# Altium schematic sheet ESP32Schematic.SchDoc
size A4; SheetNumber: 1; SheetTotal: 2
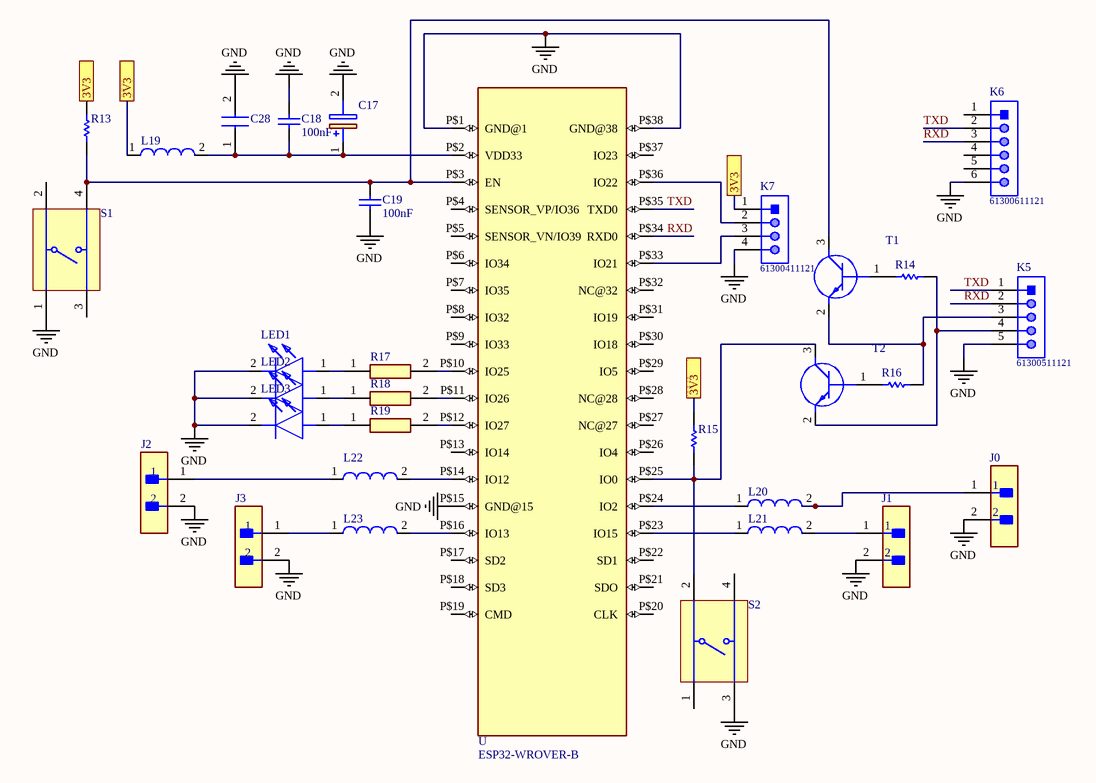
[diagram p0: ESP32Schematic.SchDoc]

## Parts
C17  (no value)  [CAPPM6032X280N]
C18  100nF  [WCAP-CSGP_0805_H=1.25mm]
C19  100nF  [WCAP-CSGP_0805_H=1.25mm]
C28  (no value)  [CAPC1608X87N]
J0  (no value)  [FP-TSW-102-07-G-S-MFG]
J1  (no value)  [FP-TSW-102-07-G-S-MFG]
J2  (no value)  [FP-TSW-102-07-G-S-MFG]
J3  (no value)  [FP-TSW-102-07-G-S-MFG]
K5  61300511121  [61300511121]
K6  61300611121  [61300611121]
K7  61300411121  [61300411121]
L19  (no value)  [SMD-1206]
L20  (no value)  [SMD-1206]
L21  (no value)  [SMD-1206]
L22  (no value)  [SMD-1206]
L23  (no value)  [SMD-1206]
LED1  (no value)  [151033GS03000]
LED2  (no value)  [151033GS03000]
LED3  (no value)  [151033GS03000]
R13  (no value)  [RESC3216X60X45NL10T20]
R14  (no value)  [RESC3216X60X45NL10T20]
R15  (no value)  [RESC3216X60X45NL10T20]
R16  (no value)  [RESC3216X60X45NL10T20]
R17  (no value)  [RESC1608X55N]
R18  (no value)  [RESC1608X55N]
R19  (no value)  [RESC1608X55N]
S1  (no value)  [TECO-1825910-6_V]
S2  (no value)  [TECO-1825910-6_V]
T1  (no value)  [SOT95P230X110-3N]
T2  (no value)  [SOT95P230X110-3N]
U  ESP32-WROVER-B  [ESP32-WROVER-B]

## Ports
3V3

## Nets
GND: C17.2(-) C18.2 C19.2 C28.2 J0.2 J1.2 J2.2 J3.2 K5.5 K6.6 K7.4 LED1.2(K) LED2.2(K) LED3.2(K) S1.1 S2.3 U.P$1(GND@1) U.P$15(GND@15) U.P$38(GND@38)
3V3: K7.1 L19.1 R13.2 R15.2 ; port 3V3
RXD: K5.2 K6.3 U.P$34(RXD0)
TXD: K5.1 K6.2 U.P$35(TXD0)
NetC17_1: C17.1(+) C18.1 C28.1 L19.2 U.P$2(VDD33)
NetC19_1: C19.1 R13.1 S1.4 T1.3(C) U.P$3(EN)
NetJ0_1: J0.1 L20.2
NetJ1_1: J1.1 L21.2
NetJ2_1: J2.1 L22.1
NetJ3_1: J3.1 L23.1
NetK5_3: K5.3 R16.2 T1.2(E)
NetK5_4: K5.4 R14.2 T2.2(E)
NetK7_2: K7.2 U.P$36(IO22)
NetK7_3: K7.3 U.P$33(IO21)
NetL20_1: L20.1 U.P$24(IO2)
NetL21_1: L21.1 U.P$23(IO15)
NetL22_2: L22.2 U.P$14(IO12)
NetL23_2: L23.2 U.P$16(IO13)
NetLED1_1: LED1.1(A) R17.1
NetLED2_1: LED2.1(A) R18.1
NetLED3_1: LED3.1(A) R19.1
NetR14_1: R14.1 T1.1(B)
NetR15_1: R15.1 S2.2 T2.3(C) U.P$25(IO0)
NetR16_1: R16.1 T2.1(B)
NetR17_2: R17.2 U.P$10(IO25)
NetR18_2: R18.2 U.P$11(IO26)
NetR19_2: R19.2 U.P$12(IO27)

Not connected (* = marked no-connect by the designer): K6 1 4 5; S1 2 3; S2 1 4; U P$4(SENSOR_VP/IO36) P$5(SENSOR_VN/IO39) P$6(IO34) P$7(IO35) P$8(IO32) P$9(IO33) P$13(IO14) P$17(SD2) P$18(SD3) P$19(CMD) P$20(CLK) P$21(SDO) P$22(SD1) P$26(IO4) P$27(NC@27) P$28(NC@28) P$29(IO5) P$30(IO18) P$31(IO19) P$32(NC@32) P$37(IO23)

## Library data of the parts
C17 = 293D476X9010C2TE3: Capacitor Polarised; Manufacturer_Name: Vishay; Datasheet Link: http://www.vishay.com/doc?40002; Height: 2.8mm; Manufacturer_Part_Number: 293D476X9010C2TE3; Mouser Part Number: 74-293D476X9010C2TE3; Mouser Price/Stock: https://www.mouser.co.uk/ProductDetail/Vishay-Sprague/293D476X9010C2TE3?qs=L4BSZja3YaLjW7yb5EwZTw%3D%3D; Arrow Part Number: 293D476X9010C2TE3; Arrow Price/Stock: https://www.arrow.com/en/products/293d476x9010c2te3/vishay
C18 C19 = 885012207128: WCAP-CSGP Multilayer Ceramic Chip Capacitor, General Purpose, size 0805, X7R, 100nF, 100V; Manufacturer: Wurth Elektronik; Rated Voltage: 100VDC; Isolation Resistance: >=1GOhm; Capacitance Tolerance: +/-10%; Technical Reference: X7R0805104K100DFCT10000; ComponentLink1Description: Manufacturer; ComponentLink1URL: http://www.we-online.de; ComponentLink2Description: Datasheet; ComponentLink2URL: https://www.we-online.com/catalog/datasheet/885012207128.pdf; Operating Temperature: -55 to +125degC; Packaging: Tape and Reel; Manufacturer Part Number: 885012207128; Published Date: May 2020; Ceramic Type: X7R; Dissipation Factor: =<2.5%; Height: 1.25mm; Mounting Technology: SMT; Size: 0805; Capacitance: 100nF
C28 = 885012206034: Capacitor; Manufacturer_Name: Wurth Elektronik; Datasheet Link: https://katalog.we-online.com/pbs/datasheet/885012206034.pdf; Height: 0.87mm; Manufacturer_Part_Number: 885012206034; Mouser Part Number: 710-885012206034; Mouser Price/Stock: https://www.mouser.com/Search/Refine.aspx?Keyword=710-885012206034
J0-J3 = CMP-02766-000084-1: CONN HEADER VERT 2POS 2.54MM; Manufacturer: Samtec; Manufacturer Part Number: TSW-102-07-G-S; Number Of Contacts: 2; Voltage Rating: 550V; Conn Orientation: Straight; Current Rating: 6.3A; Conn Gender: Male; Package: TSW-102-07-G-S; Digikey Description: CONN HEADER VERT 2POS 2.54MM; ComponentLink2URL: http://suddendocs.samtec.com/catalog_english/tsw_th.pdf; Height: 8.71mm; Temperature: -55°C to +125°C; Device Class L2: Headers and Wire Housings; ComponentLink2Description: Datasheet; Device Class L3: unset; Contact Material: Gold,Nickel; Temperature Range Low: -55°C; Temperature Range High: +125°C; RoHS: TRUE; Device Class L1: Connectors; Mouser Description: Conn Unshrouded Header HDR 2 POS 2.54mm Solder ST Thru-Hole Automotive Bulk; Number Of Rows: 1; Category: Conn; Pitch: 2.54mm; Lead Free: Yes; Automotive: No; Footprint Url: http://suddendocs.samtec.com/prints/tsw-xxx-xx-x-x-xx-xxx-footprint.pdf; Octopart: https://octopart.com/tsw-102-07-g-s-samtec-272197
K5 = CMP-1502-01068-1: THT Vertical Pin Header WR-PHD, Pitch 2.54 mm, Single Row, 5 pins; Manufacturer: Wurth Elektronik; Pin Number: 5; Contact Resistance: 20mOhm; Working Voltage: 250VAC; Pitch: 2.54mm; Withstanding Voltage: 500VAC; Rated Current: 3A; Gender: Male; Datasheet URL: https://katalog.we-online.de/em/datasheet/6130xx11121.pdf; Orientation: Vertical; Mounting Technology: THT; Row Number: Single; Package Reference: 61300511121; Publisher: WurthElektronik; Part Number: 61300511121; Packaging: Bag; Manufacturer URL: http://www.we-online.de; Operating Temperature: -40to105degC
K6 = CMP-1502-01070-1: THT Vertical Pin Header WR-PHD, Pitch 2.54 mm, Single Row, 6 pins; Manufacturer: Wurth Elektronik; Gender: Male; Pin Number: 6; Pitch: 2.54mm; Working Voltage: 250VAC; Rated Current: 3A; Withstanding Voltage: 500VAC; Contact Resistance: 20mOhm; Operating Temperature: -40to105degC; Packaging: Bag; Datasheet URL: https://katalog.we-online.de/em/datasheet/6130xx11121.pdf; Package Reference: 61300611121; Mounting Technology: THT; Publisher: WurthElektronik; Part Number: 61300611121; Manufacturer URL: http://www.we-online.de; Row Number: Single; Orientation: Vertical
K7 = CMP-1502-01064-1: THT Vertical Pin Header WR-PHD, Pitch 2.54 mm, Single Row, 4 pins; Manufacturer: Wurth Elektronik; Withstanding Voltage: 500VAC; Rated Current: 3A; Working Voltage: 250VAC; Pin Number: 4; Gender: Male; Contact Resistance: 20mOhm; Pitch: 2.54mm; Manufacturer URL: http://www.we-online.de; Operating Temperature: -40to105degC; Packaging: Bag; Mounting Technology: THT; Package Reference: 61300411121; Datasheet URL: https://katalog.we-online.de/em/datasheet/6130xx11121.pdf; Publisher: WurthElektronik; Part Number: 61300411121; Row Number: Single; Orientation: Vertical
L19-L23 = CMP-0220-00019-1: SMD EMI Suppression Ferrite Bead WE-CBF, Z = 31Ohm; ComponentLink2Description: Datasheet; Impedance: 31Ohm; DatasheetVersion: Dec-2005; PackageVersion: 2007; ComponentLink2URL: http://www.we-online.de/katalog/media/pdf/742792112.pdf; ComponentLink1URL: http://www.we-online.com; PackageReference: SMD-1206; PackageDescription: Chip Inductor, 2-Leads, Body 3.2 x 1.6 mm; ComponentLink1Description: Manufacturer Link
LED1-LED3 = 151033GS03000: LED; Manufacturer_Name: Wurth Elektronik; Datasheet Link: https://www.mouser.com/datasheet/2/445/151033GS03000-1715304.pdf; Height: 5.55mm; Manufacturer_Part_Number: 151033GS03000; Mouser Part Number: 710-151033GS03000; Mouser Price/Stock: https://www.mouser.com/Search/Refine.aspx?Keyword=710-151033GS03000
R13-R16 = CMP-2003-02453-1: Part Number: CRCW120610K0JNEB; Manufacturer: Vishay Dale
R17-R19 = RC0603JR-071KL: Resistor; Manufacturer_Name: YAGEO (PHYCOMP); Datasheet Link: http://www.yageo.com/documents/recent/PYu-RC0603_51_RoHS_L_v5.pdf; Height: 0.55mm; Manufacturer_Part_Number: RC0603JR-071KL; Mouser Part Number: 603-RC0603JR-071KL; Mouser Price/Stock: https://www.mouser.co.uk/ProductDetail/Yageo/RC0603JR-071KL?qs=%2F9ZTgpVJnN7bctK4R%2FDEoA%3D%3D; Arrow Part Number: RC0603JR-071KL; Arrow Price/Stock: https://www.arrow.com/en/products/rc0603jr-071kl/yageo
S1 S2 = CMP-1684-00021-1: Tact Switch, SPST-NO, 0.05 A, -35 to 85 degC, 4-Pin THD, RoHS, Bulk; Part No: 1825910-6; Manufacturer: TE Connectivity; Maximum Contact Resistance: 100mOhm; Mechanical Life: 100000Cycles; Bushing Type: Unthreaded; Switch Configuration: OFF(ON); Maximum DC Voltage Rating: 24V; Contact Rating @ Voltage: 0.05A@24VDC; Actuator Color: Black; Body Orientation: Straight; Function: MomentaryContact; Illumination: N/R; Actuator Style: RoundButton; Actuator Material: PolybutyleneTerephthalate; Dielectric Strength: 500VAC; Pole Throw Configuration: SPST; Actuator Length: 1.4mm; Product Weight: N/A; Contact Material: CopperAlloy; Housing Material: N/A; Terminal Type: PCPins; Minimum Insulation Resistance: 100MOhm; Package Description: 4-Pin Through Hole Device, Body 5.99 x 5.99 mm, Pitch 6.5 mm; Package Reference: THD; Base Material: N/A; Manufacturer URL: http://www.te.com; Contact Plating: Silver; RoHS: Yes; Datasheet Version: Rev. C9; Electrical Life: 100000Cycles; Maximum AC Voltage Rating: N/A; Thread Size: N/R; Operating Temperature: -35to85C; Mounting: ThroughHole; Dimension: 5.99x5mm; Datasheet URL: http://www.te.com/commerce/DocumentDelivery/DDEController?Action=showdoc&DocId=Customer+Drawing%7F1825910%7FC9%7Fpdf%7FEnglish%7FENG_CD_1825910_C9.pdf%7F1825910-6; Family: 1825910; Seal Location: N/A; Seal Description: N/A; Packaging: N/A
T1 T2 = BC847C_AU,215: Transistor BJT NPN; Manufacturer_Name: Nexperia; Manufacturer_Part_Number: BC847C/AU,215; Datasheet Link: http://assets.nexperia.com/documents/data-sheet/BC847_SER.pdf; Height: 1.1mm
U = ESP32-WROVER-B: SMD MODULE ESP32-D0WD 32MBIT; MF: Espressif Systems; MP: ESP32-WROVER-B; Value: *; Package: Module Espressif Systems; Price: None; SnapEDA_Link: https://www.snapeda.com/parts/ESP32-WROVER-B/Espressif%20Systems/view-part/2877843/?ref=snap; Availability: Unavailable; ComponentLink1Description: New link